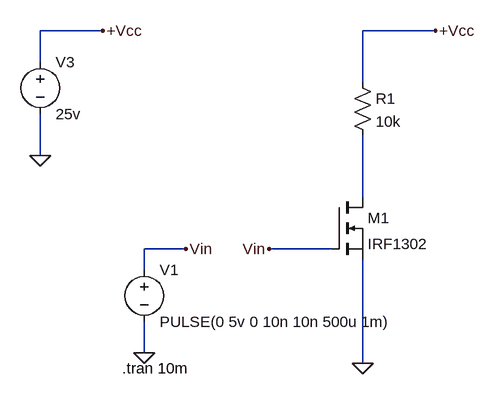
[diagram p0: schematic 2.4.2.asc]
2.4.2.asc, the LTspice schematic file:
Version 4
SHEET 1 880 760
WIRE 80 128 -16 128
WIRE 592 128 480 128
WIRE -16 176 -16 128
WIRE 480 208 480 128
WIRE -16 320 -16 256
WIRE 480 384 480 288
WIRE 208 464 144 464
WIRE 432 464 336 464
WIRE 144 496 144 464
WIRE 144 624 144 576
WIRE 480 640 480 480
FLAG 336 464 Vin
FLAG 208 464 Vin
FLAG 144 624 0
FLAG -16 320 0
FLAG 80 128 +Vcc
FLAG 592 128 +Vcc
FLAG 480 640 0
SYMBOL nmos 432 384 R0
SYMATTR InstName M1
SYMATTR Value IRF1302
SYMBOL voltage 144 480 R0
WINDOW 123 0 0 Left 0
WINDOW 39 0 0 Left 0
SYMATTR InstName V1
SYMATTR Value PULSE(0 5v 0 10n 10n 500u 1m)
SYMBOL voltage -16 160 R0
WINDOW 123 0 0 Left 0
WINDOW 39 0 0 Left 0
SYMATTR InstName V3
SYMATTR Value 25v
SYMBOL res 464 192 R0
SYMATTR InstName R1
SYMATTR Value 10k
TEXT 110 648 Left 2 !.tran 10m

The netlist it stands for:
* 2.4.2.asc
M1 N001 Vin 0 0 IRF1302
V1 Vin 0 PULSE(0 5v 0 10n 10n 500u 1m)
V3 +Vcc 0 25v
R1 +Vcc N001 10k
.model NMOS NMOS
.model PMOS PMOS
.lib standard.mos
.tran 10m
.backanno
.end